# EAGLE design SensorModule (EAGLE 7.6.0)
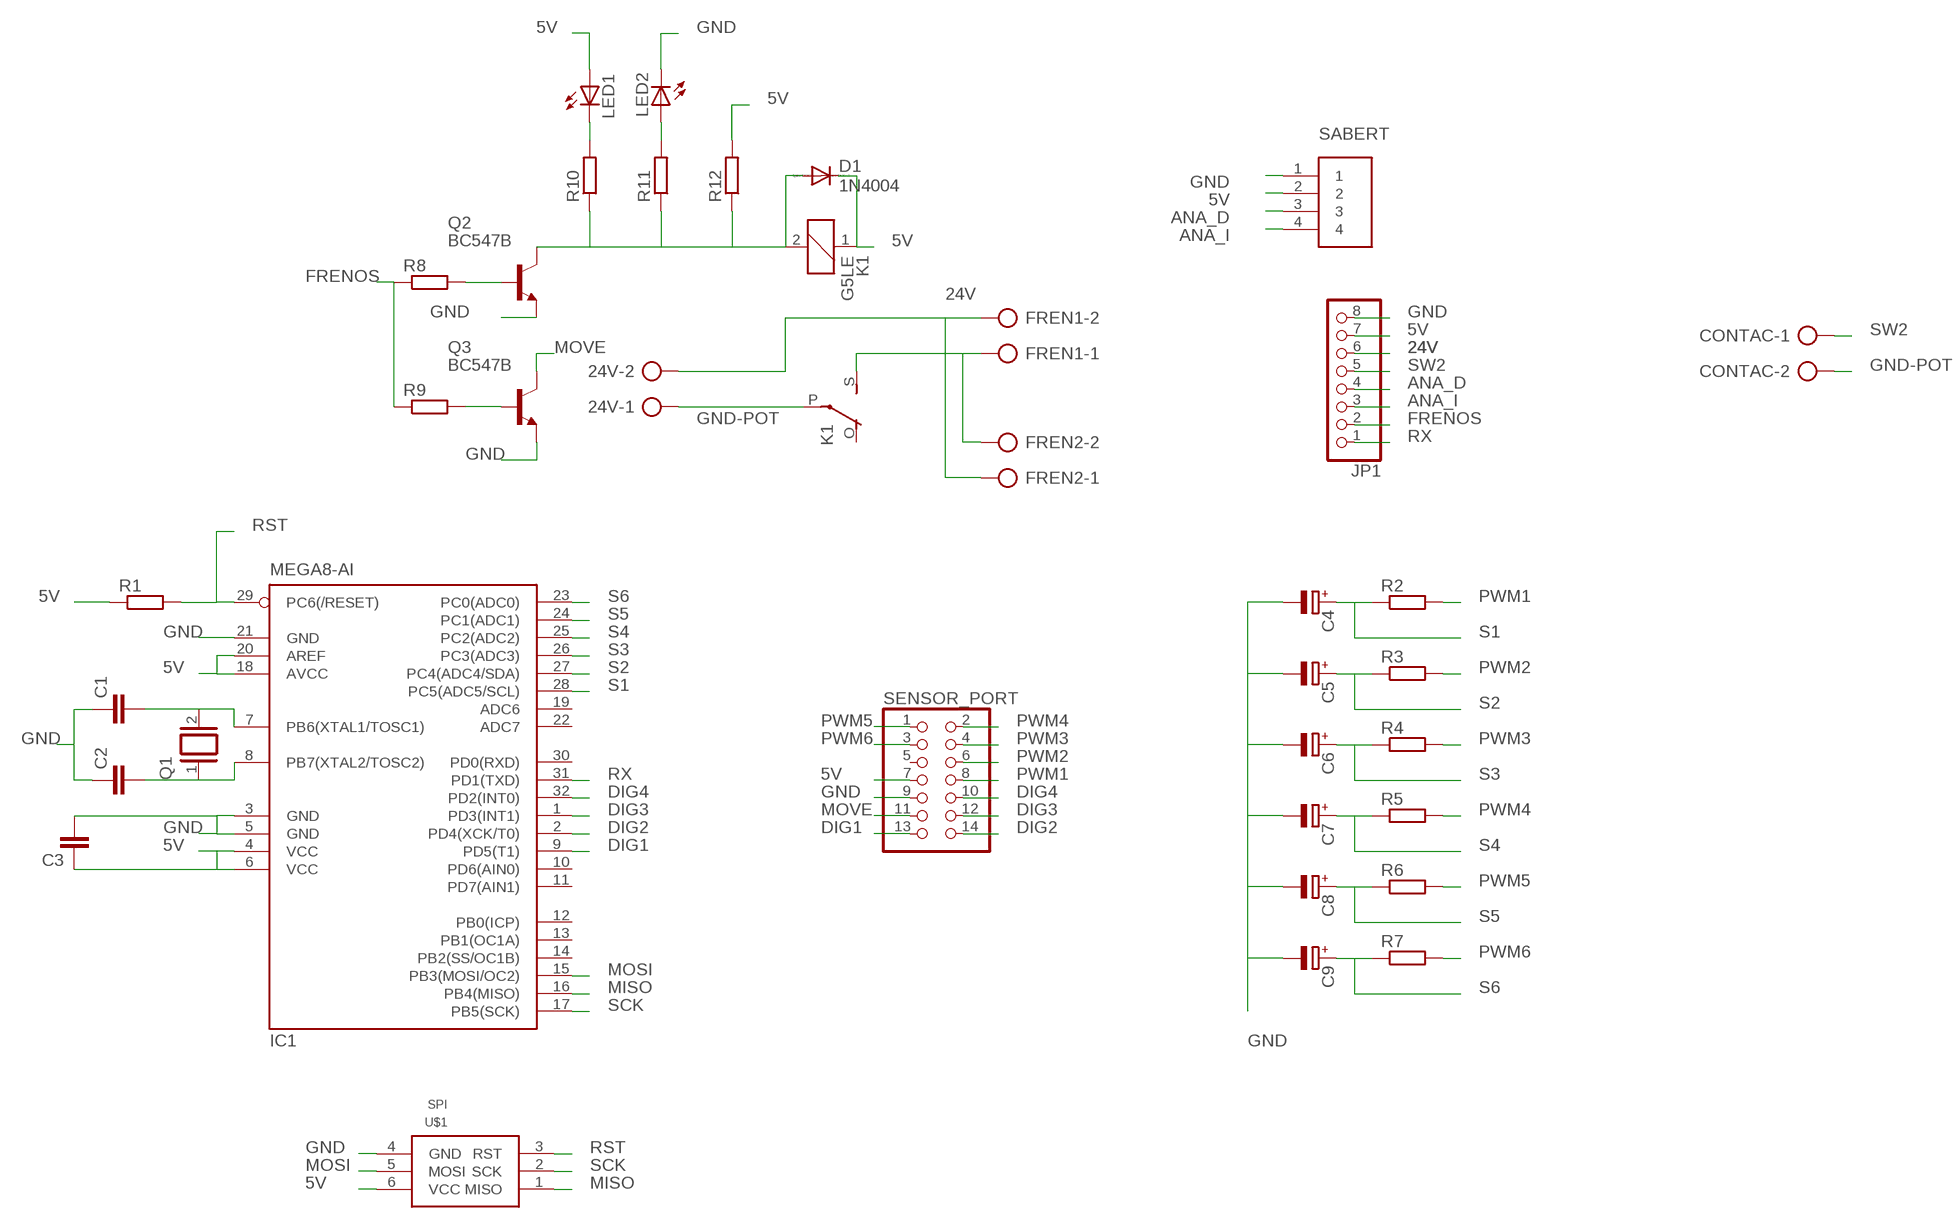
[diagram p0: schematic, sheet 1]

## Parts
24V  AK500/2  [AK500/2]
C1  C-EUC0402K  [C0402K]
C2  C-EUC0402K  [C0402K]
C3  C-EUC0402K  [C0402K]
C4  CPOL-EU153CLV-0505  [153CLV-0505]
C5  CPOL-EU153CLV-0505  [153CLV-0505]
C6  CPOL-EU153CLV-0505  [153CLV-0505]
C7  CPOL-EU153CLV-0505  [153CLV-0505]
C8  CPOL-EU153CLV-0505  [153CLV-0505]
C9  CPOL-EU153CLV-0505  [153CLV-0505]
CONTAC  AK500/2  [AK500/2]
D1  1N4004  [DO41-10]
FREN1  AK500/2  [AK500/2]
FREN2  AK500/2  [AK500/2]
IC1  MEGA8-AI  [TQFP32-08]
JP1  PINHD-1X8  [1X08]
K1  G5LE  [G5LE]
LED1  LEDCHIP-LED0603  [CHIP-LED0603]
LED2  LEDCHIP-LED0603  [CHIP-LED0603]
Q1  XTAL/S  [QS]
Q2  BC547B  [TO92]
Q3  BC547B  [TO92]
R1  R-EU_M1206  [M1206]
R2  R-EU_M1206  [M1206]
R3  R-EU_M1206  [M1206]
R4  R-EU_M1206  [M1206]
R5  R-EU_M1206  [M1206]
R6  R-EU_M1206  [M1206]
R7  R-EU_M1206  [M1206]
R8  R-EU_M1206  [M1206]
R9  R-EU_M1206  [M1206]
R10  R-EU_M1206  [M1206]
R11  R-EU_M1206  [M1206]
R12  R-EU_M1206  [M1206]
SABERT  CP2_1X4  [CP2_1X4]
SENSOR_PORT  PINHD-2X7  [2X07]
U$1  SPI  [HEAD-2X3]

## Nets
5V: C3.1 D1.C IC1.4(VCC) IC1.6(VCC) IC1.18(AVCC) IC1.20(AREF) JP1.7 K1.1 LED1.A R1.1 R12.2 SABERT.2 SENSOR_PORT.7 U$1.6(VCC)
24V: 24V.2 FREN1.2 FREN2.1 JP1.6
ANA_D: JP1.4 SABERT.3
ANA_I: JP1.3 SABERT.4
DIG1: IC1.9(PD5(T1)) SENSOR_PORT.13
DIG2: IC1.2(PD4(XCK/T0)) SENSOR_PORT.14
DIG3: IC1.1(PD3(INT1)) SENSOR_PORT.12
DIG4: IC1.32(PD2(INT0)) SENSOR_PORT.10
FRENOS: JP1.2 R8.1 R9.1
GND: C1.1 C2.1 C3.2 C4.- C5.- C6.- C7.- C8.- C9.- IC1.3(GND) IC1.5(GND) IC1.21(GND) JP1.8 LED2.C Q2.1(E) Q3.1(E) SABERT.1 SENSOR_PORT.9 U$1.4(GND)
GND-POT: 24V.1 CONTAC.2 K1.P(2:P)
MISO: IC1.16(PB4(MISO)) U$1.1(MISO)
MOSI: IC1.15(PB3(MOSI/OC2)) U$1.5(MOSI)
MOVE: Q3.3(C) SENSOR_PORT.11
N$1: Q2.2(B) R8.2
N$2: D1.A K1.2 Q2.3(C) R10.1 R11.1 R12.1
N$3: FREN1.1 FREN2.2 K1.S(2:S)
N$4: Q3.2(B) R9.2
N$5: LED1.C R10.2
N$6: C1.2 IC1.7(PB6(XTAL1/TOSC1)) Q1.2
N$7: C2.2 IC1.8(PB7(XTAL2/TOSC2)) Q1.1
N$8: LED2.A R11.2
PWM1: R2.2 SENSOR_PORT.8
PWM2: R3.2 SENSOR_PORT.6
PWM3: R4.2 SENSOR_PORT.4
PWM4: R5.2 SENSOR_PORT.2
PWM5: R6.2 SENSOR_PORT.1
PWM6: R7.2 SENSOR_PORT.3
RST: IC1.29(PC6(/RESET)) R1.2 U$1.3(RST)
RX: IC1.31(PD1(TXD)) JP1.1
S1: C4.+ IC1.28(PC5(ADC5/SCL)) R2.1
S2: C5.+ IC1.27(PC4(ADC4/SDA)) R3.1
S3: C6.+ IC1.26(PC3(ADC3)) R4.1
S4: C7.+ IC1.25(PC2(ADC2)) R5.1
S5: C8.+ IC1.24(PC1(ADC1)) R6.1
S6: C9.+ IC1.23(PC0(ADC0)) R7.1
SCK: IC1.17(PB5(SCK)) U$1.2(SCK)
SW2: CONTAC.1 JP1.5
Unconnected: IC1.10(PD6(AIN0)) IC1.11(PD7(AIN1)) IC1.12(PB0(ICP)) IC1.13(PB1(OC1A)) IC1.14(PB2(SS/OC1B)) IC1.19(ADC6) IC1.22(ADC7) IC1.30(PD0(RXD)) K1.O(2:O) SENSOR_PORT.5

## Library data of the parts
24V CONTAC FREN1 FREN2 = con-ptr500:AK500/2: CONNECTOR; OC_FARNELL: unknown; OC_NEWARK: unknown
C1-C3 = rcl:C-EU: CAPACITOR, European symbol
C4-C9 = rcl:CPOL-EU: POLARIZED CAPACITOR, European symbol
D1 = diode:1N4004: DIODE general purpose rectifier, 1 A
IC1 = atmel:MEGA8: MICROCONTROLLER 8 Kbytes FLASH, 1 kbytes SRAM, 512 bytes EEPROM, USART, 6-channel 10 bit ADC, 2-channel 8 bit ADC Pin compatible with Atmega48, ATMega88, ATMega168 Source: avr.lbr; MPN: ATMEGA8-16AU; OC_FARNELL: 9171371; OC_NEWARK: 73M8863
JP1 = pinhead:PINHD-1X8: PIN HEADER
K1 = relay:G5LE: RELAY 1 x switch, 10 A/120 V AC, 8 A/30 V DC, Omron; OC_FARNELL: unknown; OC_NEWARK: unknown
LED1 LED2 = led:LED: LED OSRAM: - CHIPLED LG R971, LG N971, LY N971, LG Q971, LY Q971, LO R971, LY R971 LH N974, LH R974 LS Q976, LO Q976, LY Q976 LO Q996 - Hyper CHIPLED LW Q18S LB Q993, LB Q99A, LB R99A - SideLED LS A670, LO A670, LY A670, LG A670, LP A670 LB A673, LV A673, LT A673, LW A673 LH A674 LY A675 LS A676, LA A676, LO A676, LY A676, LW A676 LS A679, LY A679, LG A679 - Hyper Micro SIDELED® LS Y876, LA Y876, LO Y876, LY Y876 LT Y87S - SmartLED LW L88C, LW L88S LB L89C, LB L89S, LG L890 LS L89K, LO L89K, LY L89K LS L896, LA L896, LO L896, LY L896 - TOPLED LS T670, LO T670, LY T670, LG T670, LP T670 LSG T670, LSP T670, LSY T670, LOP T670, LYG T670 LG T671, LOG T671, LSG T671 LB T673, LV T673, LT T673, LW T673 LH T674 LS T676, LA T676, LO T676, LY T676, LB T676, LH T676, LSB T676, LW T676 LB T67C, LV T67C, LT T67C, LS T67K, LO T67K, LY T67K, LW E67C LS E67B, LA E67B, LO E67B, LY E67B, LB E67C, LV E67C, LT E67C LW T67C LS T679, LY T679, LG T679 LS T770, LO T770, LY T770, LG T770, LP T770 LB T773, LV T773, LT T773, LW T773 LH T774 LS E675, LA E675, LY E675, LS T675 LS T776, LA T776, LO T776, LY T776, LB T776 LHGB T686 LT T68C, LB T68C - Hyper Mini TOPLED® LB M676 - Mini TOPLED Santana® LG M470 LS M47K, LO M47K, LY M47K Source: http://www.osram.convergy.de LUXEON: - LUMILED® LXK2-PW12-R00, LXK2-PW12-S00, LXK2-PW14-U00, LXK2-PW14-V00 LXK2-PM12-R00, LXK2-PM12-S00, LXK2-PM14-U00 LXK2-PE12-Q00, LXK2-PE12-R00, LXK2-PE12-S00, LXK2-PE14-T00, LXK2-PE14-U00 LXK2-PB12-K00, LXK2-PB12-L00, LXK2-PB12-M00, LXK2-PB14-N00, LXK2-PB14-P00, LXK2-PB14-Q00 LXK2-PR12-L00, LXK2-PR12-M00, LXK2-PR14-Q00, LXK2-PR14-R00 LXK2-PD12-Q00, LXK2-PD12-R00, LXK2-PD12-S00 LXK2-PH12-R00, LXK2-PH12-S00 LXK2-PL12-P00, LXK2-PL12-Q00, LXK2-PL12-R00 Source: www.luxeon.com KINGBRIGHT: KA-3528ASYC Source: www.kingbright.com
Q1 = special:XTAL/S: CRYSTAL
Q2 Q3 = transistor-npn:BC547*: NPN Transistor
R1-R12 = rcl:R-EU_: RESISTOR, European symbol
SABERT = cp2:CP2_1X4
SENSOR_PORT = pinhead:PINHD-2X7: PIN HEADER
U$1 = spi:SPI

## Board
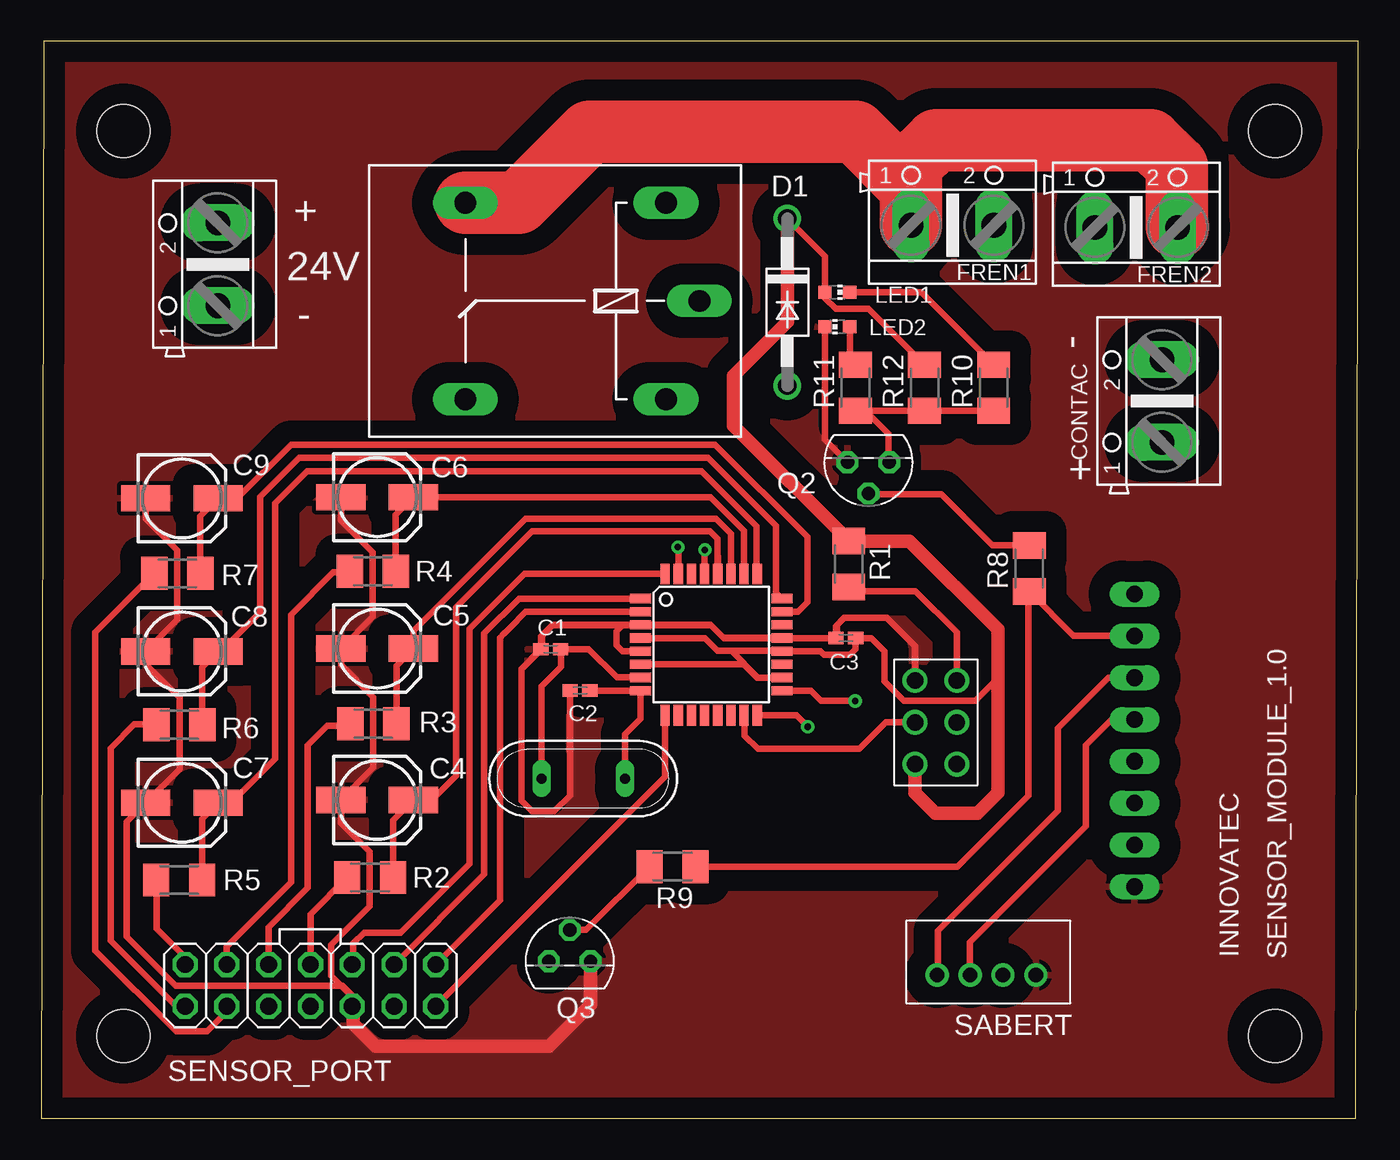
[diagram p1: board, top side]
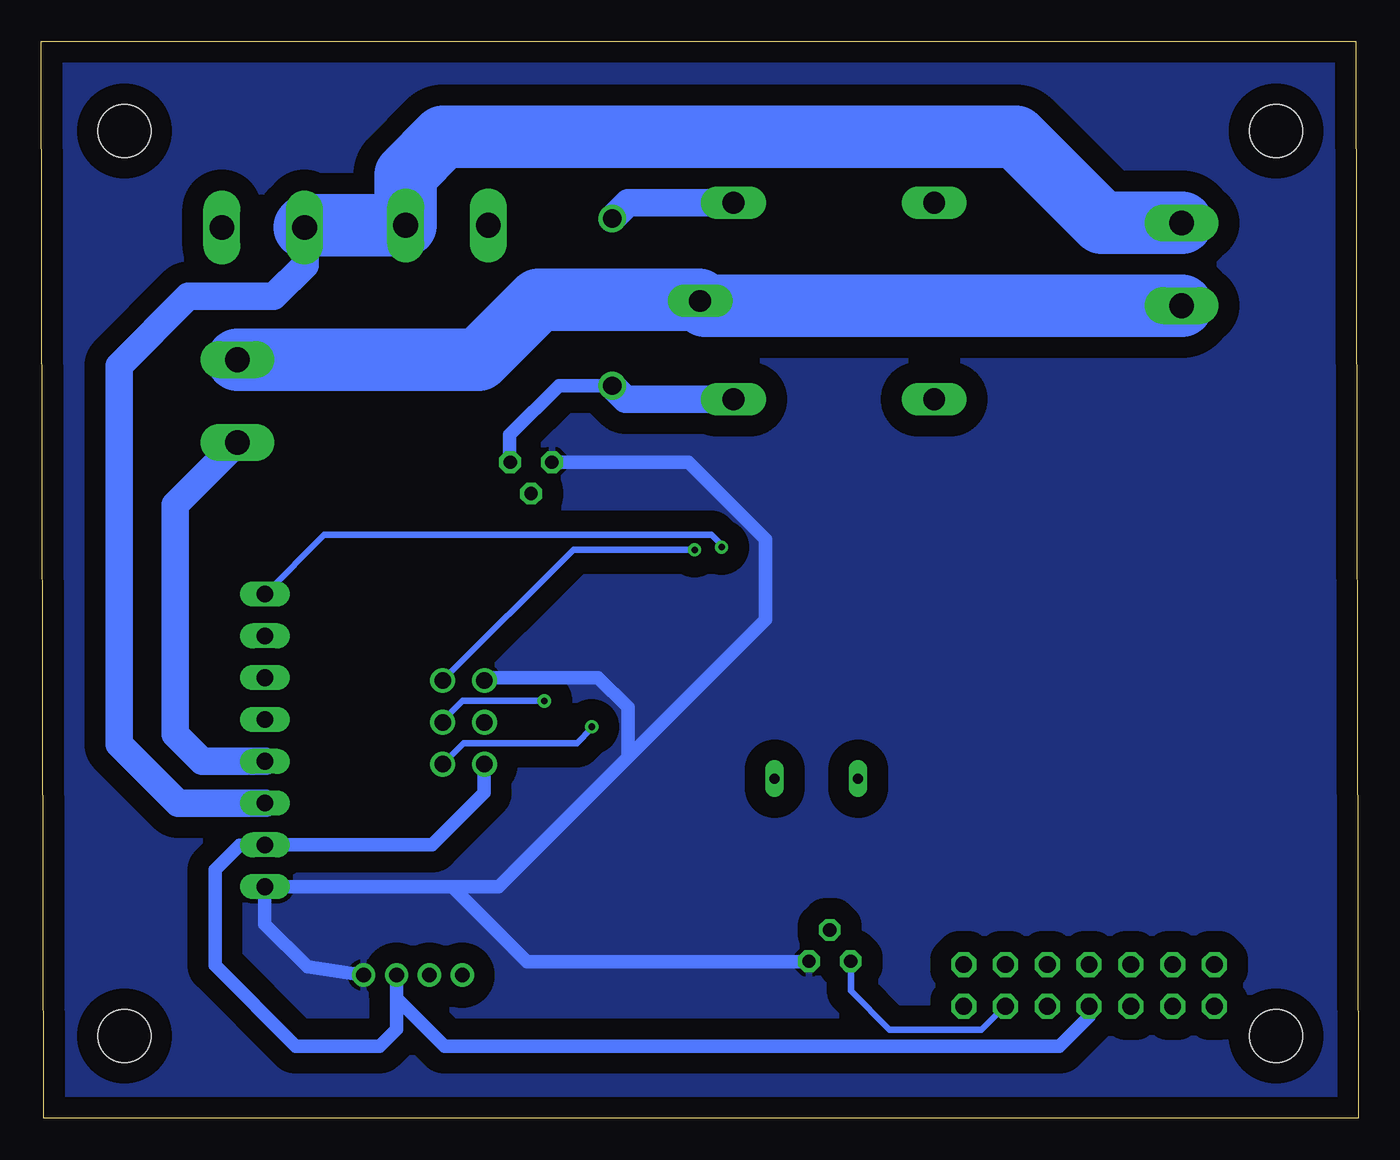
[diagram p2: board, bottom side, seen from below]

Size 80.07 x 65.46 mm. Coordinates in mm from the lower left corner, seen from the top.
Outline: 0,0 79.92,0 80.07,65.46 0.15,65.46 0,0
Copper layers (1*16): Top 0.035mm / dielectric 1.5mm / Bottom 0.035mm
Design rules "default *": minimum track width 15mil, minimum drill 16mil, track to track 10mil, track to pad 10mil, pad to pad 8mil, via to via 16mil, smd to smd 8mil, copper to edge 40mil, drill to drill 10mil, minimum pad ring 10mil, minimum via ring 8mil, stop-mask expansion 4mil, vias tented up to drill 0mil, thermal gap 10mil
Holes 3.2 mm at 75,5 75,60 5,60 5,5

### Footprints (pad centres in the part's own frame; a part is rotated, then mirrored left to right if it is on the bottom)
AK500/2 = drill 1.5 long: 1 -2.515,0; 2 2.515,0
C0402K = smd 0.925 x 0.74: 1 -0.6,0; 2 0.6,0
153CLV-0505 = smd 3 x 1.6: + 2.2,0; - -2.2,0
DO41-10 = drill 1.118: A 5.08,0; C -5.08,0
TQFP32-08 = smd 1.27 x 0.559: 1 -4.293,2.8; 2 -4.293,2; 3 -4.293,1.2; 4 -4.293,0.4; 5 -4.293,-0.4; 6 -4.293,-1.2; 7 -4.293,-2; 8 -4.293,-2.8; 17 4.293,-2.8; 18 4.293,-2; 19 4.293,-1.2; 20 4.293,-0.4; 21 4.293,0.4; 22 4.293,1.2; 23 4.293,2; 24 4.293,2.8 | smd 0.559 x 1.27: 9 -2.8,-4.293; 10 -2,-4.293; 11 -1.2,-4.293; 12 -0.4,-4.293; 13 0.4,-4.293; 14 1.2,-4.293; 15 2,-4.293; 16 2.8,-4.293; 25 2.8,4.293; 26 2,4.293; 27 1.2,4.293; 28 0.4,4.293; 29 -0.4,4.293; 30 -1.2,4.293; 31 -2,4.293; 32 -2.8,4.293
1X08 = drill 1.016 long: 1 -8.89,0; 2 -6.35,0; 3 -3.81,0; 4 -1.27,0; 5 1.27,0; 6 3.81,0; 7 6.35,0; 8 8.89,0
G5LE = drill 1.321 long: 1 -7.493,-5.969; 2 -7.493,5.969; O 4.699,5.969; P -9.525,0; S 4.699,-5.969
CHIP-LED0603 = smd 0.8 x 0.8: A 0,-0.75; C 0,0.75
QS = drill 0.61 long: 1 -2.54,0; 2 2.54,0
TO92 = drill 0.813 octagon: 1 1.27,0; 2 0,1.905; 3 -1.27,0
M1206 = smd 1.6 x 2: 1 -1.4,0; 2 1.4,0
CP2_1X4 = drill 0.9: 1 -2.9,1.3; 2 -0.9,1.3; 3 1.1,1.3; 4 3.1,1.3
2X07 = drill 1.016 octagon: 1 -7.62,-1.27; 2 -7.62,1.27; 3 -5.08,-1.27; 4 -5.08,1.27; 5 -2.54,-1.27; 6 -2.54,1.27; 7 0,-1.27; 8 0,1.27; 9 2.54,-1.27; 10 2.54,1.27; 11 5.08,-1.27; 12 5.08,1.27; 13 7.62,-1.27; 14 7.62,1.27
HEAD-2X3 = drill 1: 1 -2.54,-1.27; 2 0,-1.27; 3 2.54,-1.27; 4 2.54,1.27; 5 0,1.27; 6 -2.54,1.27

### Placement (x,y rotation side)
24V  10.74,51.9 90 top
C1  30.97,28.51 0 top
C2  32.75,26 0 top
C3  48.91,29.19 180 top
C4  20.43,19.35 0 top
C5  20.43,28.55 0 top
C6  20.43,37.75 0 top
C7  8.56,19.18 0 top
C8  8.56,28.38 0 top
C9  8.56,37.68 0 top
CONTAC  68.13,43.59 90 top
D1  45.36,49.6 270 top
FREN1  55.4,54.27 0 top
FREN2  66.57,54.14 0 top
IC1  40.73,28.79 0 top
JP1  66.46,22.97 270 top
K1  30.49,49.67 180 top
LED1  48.4,50.2 270 top
LED2  48.4,48.1 90 top
Q1  32.95,20.65 180 top
Q2  50.29,39.87 180 top
Q3  32.13,9.55 0 top
R1  49.09,33.69 270 top
R2  20,14.64 180 top
R3  20.2,23.98 180 top
R4  20.16,33.25 180 top
R5  8.39,14.49 180 top
R6  8.4,23.92 180 top
R7  8.28,33.12 180 top
R8  60.06,33.42 90 top
R9  38.38,15.3 180 top
R10  57.9,44.4 90 top
R11  49.5,44.4 90 top
R12  53.7,44.4 90 top
SABERT  57.57,10.01 180 top
SENSOR_PORT  16.37,8.08 0 top
U$1  54.39,24.07 90 top

### Tracks (layer width: path | path; a pad name or v marks a point on that pad's centre or on a via)
5V
  Top 0.406: IC1.4 40.34,29.19 41.12,28.41 41.95,28.41 | 41.95,28.41 45,28.41 IC1.20 47.36,28.39 47.58,28.17 49.18,28.17 49.51,28.5 C3.1 50.46,29.19 51.26,28.39 51.26,26.57 52.44,25.39 56.78,25.39 58.15,26.76 | IC1.6 42.69,27.59 43.5,26.78 IC1.18 43.57,26.79 41.95,28.41 | D1.C 47.65,52.39 LED1.A 47.65,49.85 48.3,49.2 50.3,49.2 R12.2
  Top 0.813: D1.C 45.36,48.4 42.1,45.14 42.1,42.08 R1.1 49.11,35.07 52.79,35.07 58.15,29.71 58.15,26.76 58.15,19.79 56.91,18.55 54.37,18.55 53.12,19.8 U$1.6
  Bottom 0.813: SENSOR_PORT.7 16.37,6.19 18.17,4.39 55.55,4.39 58.45,7.29 58.45,8.69 SABERT.2 58.47,5.43 59.5,4.4 64.6,4.4 69.5,9.3 69.5,15.1 68,16.6 66.48,16.6 JP1.7 56.3,16.62 53.13,19.79 U$1.6
  Bottom 1.676: K1.1 44.4,55.64 D1.C
24V
  Bottom 1.676: JP1.6 71.74,19.16 75.33,22.75 75.33,45.75 71.13,49.95 65.93,49.95 64.03,51.85 64.03,54.12 FREN2.1
  Bottom 3.81: 24V.2 15.6,54.41 20.83,59.65 55.63,59.65 57.93,57.35 57.93,54.28 FREN1.2 63.92,54.27 FREN2.1
ANA_D
  Top 0.406: SABERT.3 56.47,10.72 63.51,17.76 63.51,22.69 64.98,24.16 66.38,24.16 JP1.4
ANA_I
  Top 0.406: JP1.3 64.88,26.78 61.8,23.7 61.8,18.7 54.5,11.4 54.5,8.74 SABERT.4
DIG1
  Top 0.406: IC1.9 37.93,20.75 SENSOR_PORT.13
DIG2
  Top 0.406: IC1.2 29.46,30.79 28.49,29.82 28.49,29.81 28.16,29.48 28.15,29.48 27.89,29.22 27.89,13.25 SENSOR_PORT.14
DIG3
  Top 0.406: IC1.1 29.06,31.59 26.94,29.47 26.94,14.84 SENSOR_PORT.12
DIG4
  Top 0.406: IC1.32 29.37,33.08 26.04,29.75 26.04,15.47 21.84,11.27 19.62,11.27 18.98,10.63 18.98,9.42 SENSOR_PORT.10
FRENOS
  Top 0.406: JP1.2 62.76,29.32 R8.1 60,31.96 60,19.6 55.7,15.3 R9.1
GND
  Top 0.406: 35.37,29.99 IC1.3 40.7,29.99 41.49,29.2 IC1.21 C3.2 48.31,29.92 48.8,30.41 51.4,30.41 53.12,28.69 U$1.4 | 35.37,29.99 31.08,29.99 30.38,29.29 C1.1 29.19,27.33 | IC1.5 35.33,28.39 34.97,28.75 34.97,29.59 35.37,29.99 | C2.1 32.15,19.62 31.18,18.65 29.85,18.65 29.19,19.31 29.19,27.33 | C9.- 6.36,36.43 8.27,34.52 8.27,30.29 C8.- 6.36,27.61 8.41,25.56 8.41,21.23 C7.- 5.2,18.02 5.2,11.03 8.17,8.06 18.34,8.06 18.91,7.49 18.91,7.39 | SENSOR_PORT.9 18.91,7.39 | C6.- 18.23,36.33 20.15,34.41 20.15,30.47 C5.- 18.23,27.56 20.19,25.6 20.19,21.31 C4.- 18.23,17.93 19.97,16.19 19.97,12.9 17.62,10.55 17.62,8.68 18.91,7.39 | 29.19,27.33 29.23,27.33 30.45,28.55 30.45,29.34 31.09,29.98 40.72,29.98 41.52,29.18 C3.2 48.36,29.23 48.36,29.96 48.82,30.42 51.39,30.42 53.13,28.68 53.13,26.58 | LED2.C 47.65,41.24 Q2.1
  Top 0.813: Q3.1 33.4,6.91 30.88,4.39 20.32,4.39 18.96,5.75 18.96,6.76 SENSOR_PORT.9
  Bottom 0.813: SABERT.1 63.88,9.21 66.48,11.81 66.48,14.06 JP1.8 55.09,14.08 | 55.09,14.08 50.54,9.53 33.42,9.53 Q3.1 | 55.09,14.08 52.27,14.08 44.4,21.95 | 44.4,21.95 44.4,24.97 46.21,26.78 52.95,26.78 U$1.4 | Q2.1 40.73,39.87 36.05,35.19 36.05,30.3 44.4,21.95
  pour Top (isolate 1.27): 0.7,64.9 79.4,64.9 79.4,0.9 0.7,0.9
  pour Bottom (isolate 1.27): 0.9,64.8 78.9,64.8 78.9,1.4 0.9,1.4
GND-POT
  Bottom 3.81: 24V.1 39.73,49.38 K1.P 40.09,49.75 49.83,49.75 53.48,46.1 CONTAC.2
MISO  (via drill 0.4)
  Top 0.406: IC1.16 45.9,24.5 v46.6,23.8
  Bottom 0.406: v46.6,23.8 46.6,23.7 47.5,22.8 54.39,22.8 U$1.1
MOSI
  Top 0.406: U$1.5 51.34,24.07 49.73,22.46 43.56,22.46 42.76,23.26 42.76,24.47 IC1.15
MOVE
  Bottom 0.406: SENSOR_PORT.11 21.49,6.81 22.9,5.4 28.49,5.4 30.84,7.75 30.84,9.53 Q3.3
N$1
  Top 0.406: R8.2 57.82,34.82 54.71,37.93 50.33,37.93 Q2.2
N$2
  Top 0.406: R10.1 R12.1 R11.1 50.12,43 51.51,41.61 51.51,39.92 Q2.3
  Bottom 0.813: D1.A 48.6,44.52 51.59,41.53 51.59,39.9 Q2.3
  Bottom 1.676: K1.2 44.54,43.7 D1.A
N$3
  Top 3.81: FREN1.1 52.88,56.55 | 52.88,56.55 52.88,57.91 54.43,59.45 67.43,59.45 69.03,57.85 69.03,54.2 FREN2.2 | K1.S 29.02,55.64 33.33,59.95 49.48,59.95 52.88,56.55
N$4
  Top 0.406: Q3.2 33.13,11.46 R9.2
N$5
  Top 0.406: LED1.C 53.5,50.2 R10.2
N$6
  Top 0.406: IC1.7 36.43,26.8 35,26.8 33.29,28.51 C1.2 31.61,28.47 31.61,27.45 30.41,26.25 Q1.2
N$7
  Top 0.406: C2.2 IC1.8 36.44,24.29 35.48,23.33 Q1.1
N$8
  Top 0.406: LED2.A 49.15,46.15 R11.2
PWM1
  Top 0.406: SENSOR_PORT.8 16.37,12.41 R2.2
PWM2
  Top 0.406: SENSOR_PORT.6 13.83,11.63 16.21,14.01 16.21,22.68 17.38,23.85 18.67,23.85 R3.2
PWM3
  Top 0.406: SENSOR_PORT.4 11.29,10.44 15.2,14.35 15.2,30.62 17.76,33.18 18.69,33.18 R4.2
PWM4
  Top 0.406: SENSOR_PORT.2 8.75,9.8 7.02,11.53 7.02,14.46 R5.2
PWM5
  Top 0.406: SENSOR_PORT.1 8.22,6.81 4.23,10.8 4.23,22.5 5.67,23.94 6.98,23.94 R6.2
PWM6
  Top 0.406: SENSOR_PORT.3 11.29,6.49 10.1,5.3 8.2,5.3 3.3,10.2 3.3,29.54 R7.2
RST  (via drill 0.4)
  Top 0.406: U$1.3 55.66,29.53 53.15,32.04 49.34,32.04 R1.2 | IC1.29 40.33,34.53 v40.35,34.55
  Bottom 0.406: v40.35,34.55 47.72,34.55 U$1.3
RX  (via drill 0.4)
  Top 0.406: IC1.31 38.73,34.69 v38.71,34.71
  Bottom 0.406: v38.71,34.71 38.71,34.86 39.31,35.46 62.86,35.46 JP1.1
S1
  Top 0.406: R2.1 21.4,18.12 C4.+ 23.77,19.35 25.23,20.81 25.23,31.07 29.85,35.69 40.65,35.69 41.12,35.22 41.12,33.09 IC1.28 41.13,34.15
S2
  Top 0.406: R3.1 21.6,27.52 C5.+ 22.63,29.62 29.45,36.44 41.03,36.44 41.93,35.54 IC1.27
S3
  Top 0.406: R4.1 21.56,36.68 C6.+ 40.69,37.75 42.73,35.71 IC1.26
S4
  Top 0.406: R5.1 9.79,18.21 C7.+ 11.55,19.18 14.23,21.86 14.23,37.39 16.18,39.34 40.13,39.34 43.49,35.98 43.49,33.12 IC1.25
S5
  Top 0.406: R6.1 9.8,27.42 C8.+ 10.95,28.38 13.32,30.75 13.32,37.77 15.69,40.14 40.55,40.14 44.68,36.01 44.68,31.93 IC1.24
S6
  Top 0.406: R7.1 9.68,36.6 C9.+ 11.93,37.68 15.2,40.95 40.97,40.95 46.59,35.33 46.59,31.36 46.01,30.78 45.03,30.78 IC1.23
SCK  (via drill 0.4 pad 0.61)
  Top 0.406: v49.48,25.37 47.4,25.37 46.78,25.99 IC1.17
  Bottom 0.406: U$1.2 55.66,24.16 54.45,25.37 v49.48,25.37
SW2
  Bottom 1.676: JP1.5 70.28,21.7 71.93,23.35 71.93,37.27 CONTAC.1

### Text on the board
tPlace: + | - | - | + | INNOVATEC | SENSOR_MODULE_1.0